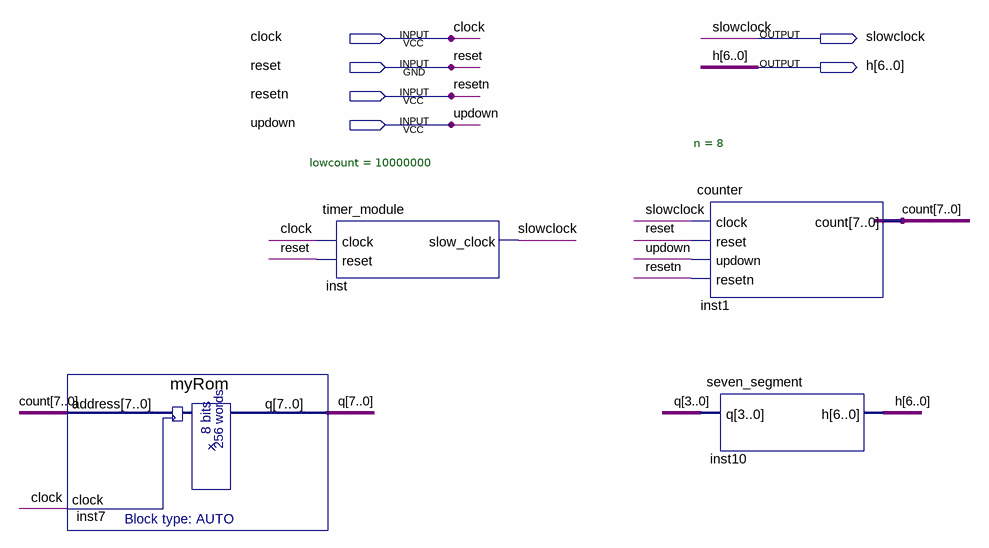
[diagram p0: schematic sheet]
// Quartus schematic lab9.bdf as structural Verilog: 4 symbols, 6 pins
module lab9 (
  input  clock,
  input  reset,
  input  resetn,
  input  updown,
  output slowclock,
  output [6:0] h
);

  wire [7:0] count, q;

  myRom inst7 (.address(count), .clock(clock), .q(q));
  timer_module #(.lowcount(10000000)) inst (.clock(clock), .reset(reset), .slow_clock(slowclock));
  counter #(.n(8)) inst1 (.clock(slowclock), .reset(reset), .updown(updown), .resetn(resetn), .count(count));
  seven_segment inst10 (.q(q[3:0]), .h(h));
endmodule
